# EAGLE design Soil_Moisture_Sensor (EAGLE 8.3.2)
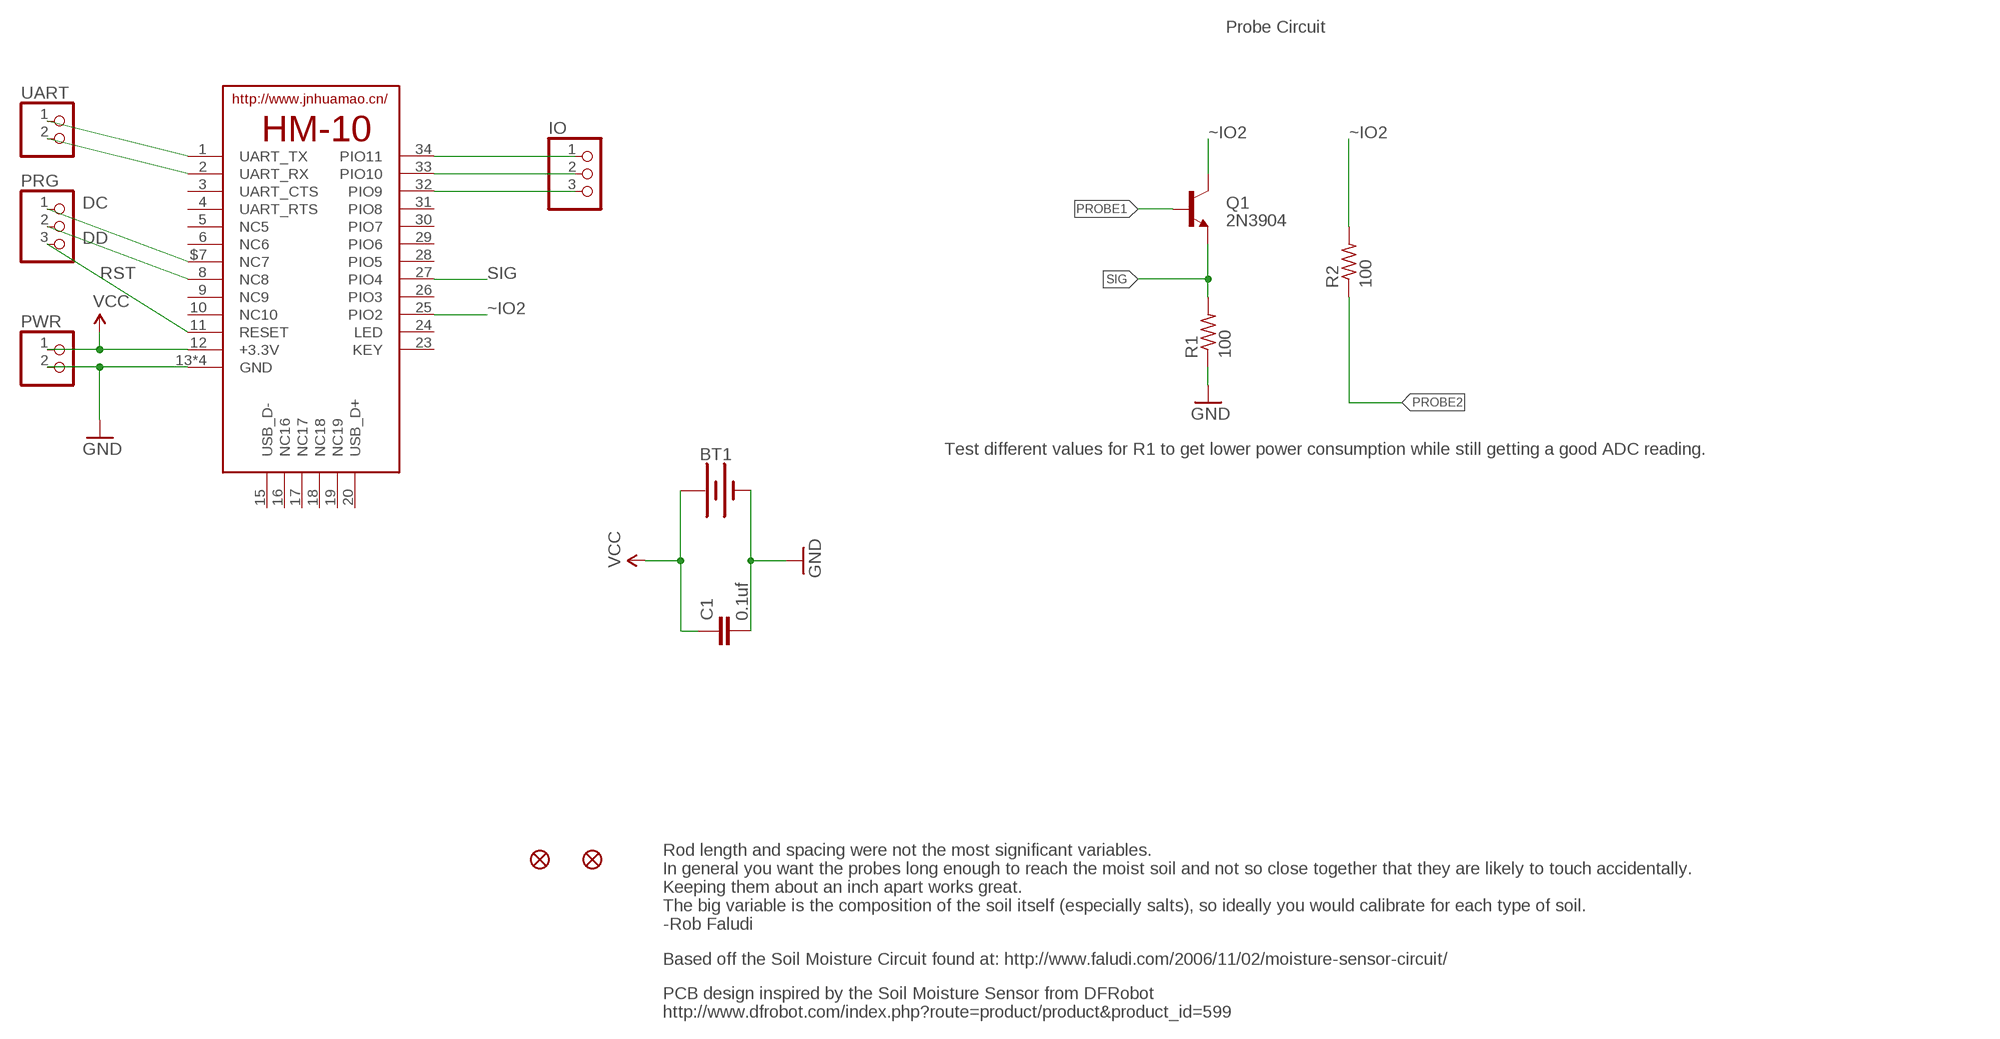
[diagram p0: schematic, sheet 1]

## Parts
BT1  BATTERY-20MM_SMD_4LEGS  [BATTCON_20MM_4LEGS]
C1  0.1uf  C-EUC0805  [C0805]
FD1  FIDUCIAL1X2  [FIDUCIAL-1X2]
FD2  FIDUCIAL1X2  [FIDUCIAL-1X2]
HM-10  HM-10-BOARD  [26.9X13X2.2_BOARD]
IO  PINHD-1X3  [1X03]
PRG  PINHD-1X3  [1X03]
PWR  PINHD-1X2  [1X02]
Q1  2N3904  TRANSISTOR_NPNMMBT2222A  [SOT23-3]
R1  100  R-US_R0805  [R0805]
R2  100  R-US_R0805  [R0805]
UART  PINHD-1X2  [1X02]

## Nets
DC: HM-10.$7(NC7) PRG.1
DD: HM-10.8(NC8) PRG.2
GND: BT1.NEGATIVE(-) C1.2 HM-10.13(GND) HM-10.14(GND) HM-10.21(GND) HM-10.22(GND) PWR.2 R1.1
N$2: HM-10.34(PIO11) IO.1
N$3: HM-10.33(PIO10) IO.2
N$4: HM-10.32(PIO9) IO.3
N$10: HM-10.1(UART_TX) UART.1
N$11: HM-10.2(UART_RX) UART.2
PROBE1: Q1.1(B)
PROBE2: R2.1
RST: HM-10.11(RESET) PRG.3
SIG: HM-10.27(PIO4) Q1.2(E) R1.2
VCC: BT1.POSITIVE@1(+) BT1.POSITIVE@2(+) BT1.POSITIVE@3(+) BT1.POSITIVE@4(+) C1.1 HM-10.12(+3.3V) PWR.1
~IO2: HM-10.25(PIO2) Q1.3(C) R2.2
Unconnected: HM-10.3(UART_CTS) HM-10.4(UART_RTS) HM-10.5(NC5) HM-10.6(NC6) HM-10.9(NC9) HM-10.10(NC10) HM-10.15(USB_D-) HM-10.16(NC16) HM-10.17(NC17) HM-10.18(NC18) HM-10.19(NC19) HM-10.20(USB_D+) HM-10.23(KEY) HM-10.24(LED) HM-10.26(PIO3) HM-10.28(PIO5) HM-10.29(PIO6) HM-10.30(PIO7) HM-10.31(PIO8)

## Notes on the sheet
- Probe Circuit
- Test different values for R1 to get lower power consumption while still getting a good ADC reading.
- Rod length and spacing were not the most significant variables. 
  In general you want the probes long enough to reach the moist soil and not so close together that they are likely to touch accidentally. 
  Keeping them about an inch apart works great. 
  The big variable is the composition of the soil itself (especially salts), so ideally you would calibrate for each type of soil. 
  -Rob Faludi
- Based off the Soil Moisture Circuit found at: http://www.faludi.com/2006/11/02/moisture-sensor-circuit/
- PCB design inspired by the Soil Moisture Sensor from DFRobot
  http://www.dfrobot.com/index.php?route=product/product&product_id=599

## Library data of the parts
BT1 = SparkFun-Batteries:BATTERY: Battery - Single Cell A variety of battery chemistries, sizes, and footprints. Device List: 20MM_PTH - Coin Cell Battery Holder - 20mm (PTH) <https://www.sparkfun.com/products/783> 6.8MM_PTH - Coin Cell Battery Holder - 6.8MM(SMD) <https://www.digikey.com/product-detail/en/seiko-instruments/MS621FE-FL11E/728-1057-ND/1889208?WT.srch=1&gclid=CNOQ5a6LzdQCFZS2wAodXCkE0g> 12MM_SMD - Coin Cell Battery Holder - 12mm (SMD) <https://www.sparkfun.com/products/10592> 12MM_PTH - Coin Cell Battery Holder - 12mm (PTH) <https://www.sparkfun.com/products/7948> 20MM_SMD - 20mm Coin Cell Battery Holder (SMD) (2 legs) Used on the Big Time Watch Kit <https://www.sparkfun.com/products/11734> 20MM_SMD_4LEGS - Coin Cell Battery Holder - 20mm (SMD) <https://www.sparkfun.com/products/11892> 20MM_SMD_4LEGS_OVERPASTE - Coin Cell Battery Holder - 20mm (SMD) <https://www.sparkfun.com/products/11892> (Over-paste on the legs) 24.5MM_PTH - Coin Cell Battery Holder - 24.5mm (PTH) <https://www.sparkfun.com/products/8863> 9V - 9V Battery Holder - PC Mount Used on the SparkFun SparkPunk Sound Kit <https://www.sparkfun.com/products/11177> and SparkFun SparkPunk Sequencer Kit <https://www.sparkfun.com/products/12707> 18650 - Battery Holder - 18650 (PTH) <https://www.sparkfun.com/products/13113> AA - Battery Holder - 1xAA (PTH) <https://www.sparkfun.com/products/7949> AAA - Battery Holder - 1xAAA (PTH) <https://www.sparkfun.com/products/12718> AA_KIT - Battery Holder - 1xAA (PTH) <https://www.sparkfun.com/products/7949> Special kit package - pads only have exposed copper on one side of the board. AAA_KIT - Battery Holder - 1xAAA (PTH) <https://www.sparkfun.com/products/12718> Special kit package - pads only have exposed copper on one side of the board.; PROD_ID: BATT-10373; SF_SKU: PRT-11892
C1 = rcl:C-EU: CAPACITOR, European symbol
FD1 FD2 = SparkFun-Aesthetics:FIDUCIAL: Fiducial Alignment Points Point-of-reference for pick-and-place machines and other optical instruments.
HM-10 = JNHuaMao:HM-10: HM Bluetooth module use TI CC2540 or CC2541, Master and slave roles in one, transmission version and remote control version and PIO state acquisition functions in one, Support the AT command modify module parameters, Convenient and flexible.
IO PRG = pinhead:PINHD-1X3: PIN HEADER
PWR UART = pinhead:PINHD-1X2: PIN HEADER
Q1 = SparkFun-DiscreteSemi:TRANSISTOR_NPN: Generic NPN BJT MMBT2222A - TRANS-08049 (SOT-23, 1A 40V) MPSA42 - TRANS-09116 (SOT-23, 500mA 300V) MMBT5088LT1G - TRANS-11160 (SOT-23, 50 mA 30V) BC547 - COM-08928 <http://www.sparkfun.com/products/8928> (TO-92 45V 100mA) (1.Collector 2.Base 3.Emitter) 2N3904 - COM-00521 <http://www.sparkfun.com/products/521> (TO-92 40V 200mA) (1.Emitter 2.Base 3.Collector) P2N2222A - COM-12852 <http://www.sparkfun.com/products/12852> (TO-92 40V 600mA) (1.Collector 2.Base 3.Emitter); PROD_ID: TRANS-08049; VALUE: MMBT2222A
R1 R2 = resistor:R-US_: RESISTOR, American symbol

## Board
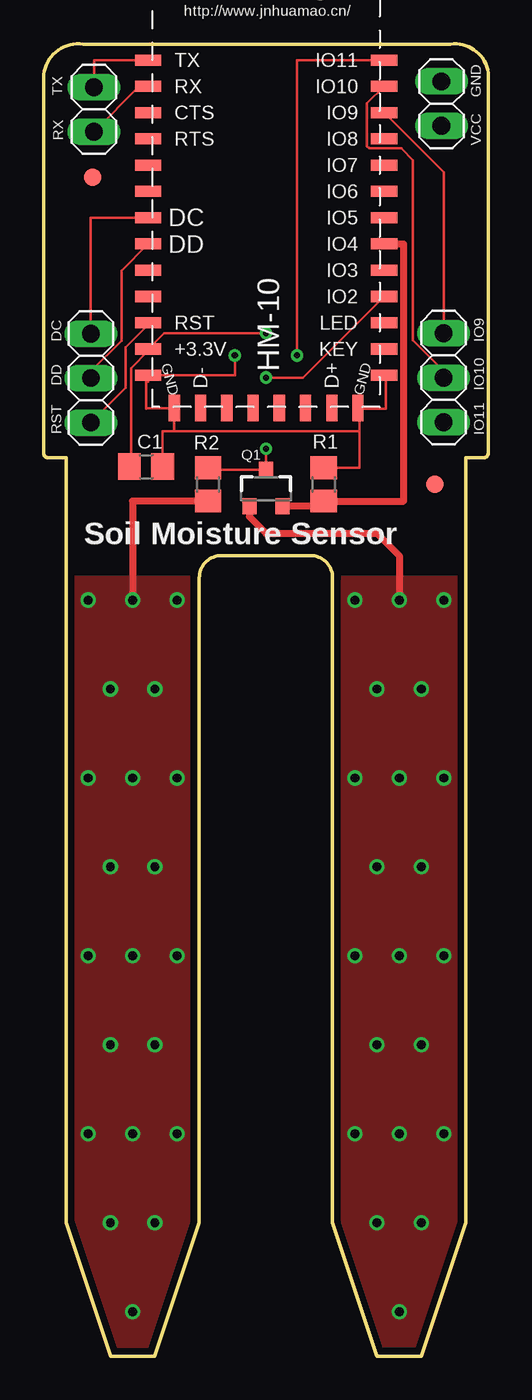
[diagram p1: board, top side]
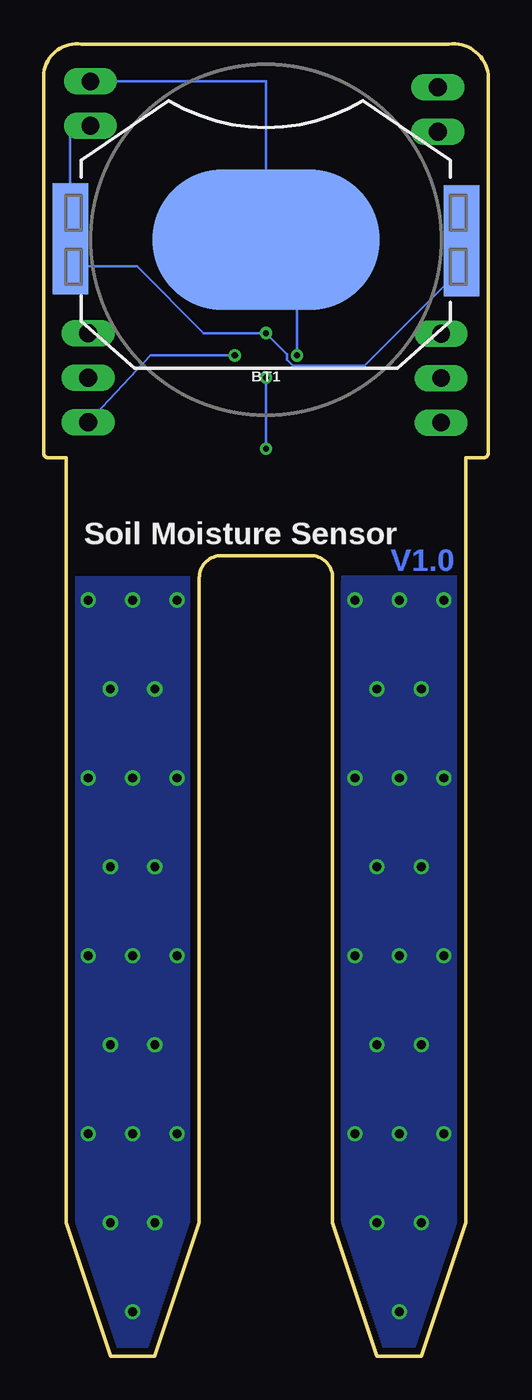
[diagram p2: board, bottom side, seen from below]

Size 25.4 x 74.95 mm. Coordinates in mm from the lower left corner, seen from the top.
Outline: 1.27,7.62 1.27,51.31 0.25,51.31 arc-90 0,51.56 0,73.2 arc-90 2.24,74.93 23.25,74.93 arc-90 25.4,73.29 25.4,51.56 arc-90 25.15,51.31 24.13,51.31 24.13,7.62 21.59,0 19.05,0 16.51,7.62 16.51,44.45 arc90 15.24,45.72 10.16,45.72 arc90 8.89,44.45 8.89,7.62 6.35,0 3.81,0 1.27,7.62
Copper layers (1*16): Top 0.0356mm / dielectric 1.5011mm / Bottom 0.0356mm
Design rules "oshpark-2layer": minimum track width 6mil, minimum drill 13mil, track to track 6mil, track to pad 6mil, pad to pad 6mil, via to via 6mil, smd to smd 6mil, copper to edge 15mil, drill to drill 6mil, minimum pad ring 7mil, minimum via ring 7mil, stop-mask expansion 2.5mil, vias tented up to drill 0mil, thermal gap 10mil

### Footprints (pad centres in the part's own frame; a part is rotated, then mirrored left to right if it is on the bottom)
BATTCON_20MM_4LEGS = smd 13 x 8: NEGATIVE 0,0 | smd 2.032 x 3.175: POSITIVE@1 -11.176,1.651; POSITIVE@2 -11.176,-1.524; POSITIVE@3 11.176,1.524; POSITIVE@4 11.176,-1.651
C0805 = smd 1.3 x 1.5: 1 -0.95,0; 2 0.95,0
FIDUCIAL-1X2 = smd 1 x 1: 1 0,0
26.9X13X2.2_BOARD = smd 1.5 x 0.635: 1 -7.5,0; 2 -7.5,-1.5; 3 -7.5,-3; 4 -7.5,-4.5; 5 -7.5,-6; 6 -7.5,-7.5; 8 -7.5,-10.5; 9 -7.5,-12; 10 -7.5,-13.5; 11 -7.5,-15; 12 -7.5,-16.5; 13 -7.5,-18; 22 6,-18; 23 6,-16.5; 24 6,-15; 25 6,-13.5; 26 6,-12; 27 6,-10.5; 28 6,-9; 29 6,-7.5; 30 6,-6; 31 6,-4.5; 32 6,-3; 33 6,-1.5; 34 6,0; $7 -7.5,-9 | smd 0.635 x 1.5: 14 -6,-19.875; 15 -4.5,-19.875; 16 -3,-19.875; 17 -1.5,-19.875; 18 0,-19.875; 19 1.5,-19.875; 20 3,-19.875; 21 4.5,-19.875
1X03 = drill 1.016 long: 1 -2.54,0; 2 0,0; 3 2.54,0
1X02 = drill 1.016 long: 1 -1.27,0; 2 1.27,0
SOT23-3 = smd 0.8 x 0.9: 1 -0.95,-1; 2 0.95,-1; 3 0,1.1
R0805 = smd 1.3 x 1.5: 1 -0.95,0; 2 0.95,0

### Placement (x,y rotation side)
BT1  12.7,63.75 180 bottom
C1  5.84,50.8 0 top
FD1  2.79,67.31 0 top
FD2  22.35,49.78 0 top
HM-10  13.46,74.02 0 top
IO  22.86,55.88 90 top
PRG  2.69,55.85 270 top
PWR  22.73,71.53 90 top
Q1  12.7,49.53 0 top
R1  16,49.78 270 top
R2  9.4,49.78 90 top
UART  2.87,71.2 270 top

### Tracks (layer width: path | path; a pad name or v marks a point on that pad's centre or on a via)
DC
  Top 0.152: 5.96,64.91 HM-10.$7 2.69,65.02 PRG.1
DD
  Top 0.152: PRG.2 2.69,56.23 4.45,57.98 4.45,62 HM-10.8
GND  (via drill 0.35)
  Top 0.152: 5.96,55.64 HM-10.13 | HM-10.14 7.57,54.14 | HM-10.13 5.84,55.9 5.84,54.1 5.88,54.14 HM-10.14 | HM-10.22 19.56,56.02 19.56,54.1 17.96,54.1 HM-10.21 18.03,54.14 18.03,52.83 | 7.46,52.83 HM-10.14 | 18.03,52.83 7.46,52.83 | HM-10.13 10.92,56.02 v10.92,57.15 | C1.2 6.79,52.83 7.46,52.83 | R1.1 18.03,50.73 18.03,52.83
  Bottom 0.152: v10.92,57.15 10.92,63.75 BT1.NEGATIVE 12.7,72.8 PWR.2
N$2  (via drill 0.35)
  Top 0.152: HM-10.34 14.48,74.02 v14.48,57.15
  Bottom 0.152: v14.48,57.15 19.3,57.15 IO.1
N$3
  Top 0.152: IO.2 22.86,56.26 21.11,58.01 21.11,68.3 20.44,68.97 18.62,68.97 18.48,69.1 18.48,71.54 HM-10.33
N$4
  Top 0.152: HM-10.32 22.86,67.62 IO.3
N$10
  Top 0.152: HM-10.1 2.87,74.02 UART.1
N$11
  Top 0.152: HM-10.2 5.46,72.52 UART.2
PROBE1  (via drill 0.51)
  Top 0.406: Q1.1 11.75,47.94 12.7,46.99 19.05,46.99 20.32,45.72 v20.32,43.18
  other vias: 17.78,43.18 22.86,43.18 22.86,33.02 20.32,33.02 17.78,33.02 17.78,22.86 20.32,22.86 22.86,22.86 22.86,12.7 20.32,12.7 17.78,12.7 19.05,7.62 21.59,7.62 20.32,2.54 19.05,38.1 21.59,38.1 21.59,27.94 19.05,27.94 19.05,17.78 21.59,17.78
  pour Top: 16.51,44.45 16.51,0 24.13,0 24.13,44.45
  pour Bottom (isolate 0.305): 16.51,44.45 16.51,0 24.13,0 24.13,44.45
PROBE2  (via drill 0.51)
  Top 0.406: R2.1 5.08,48.83 v5.08,43.18
  other vias: 7.62,43.18 2.54,43.18 2.54,33.02 5.08,33.02 7.62,33.02 7.62,22.86 5.08,22.86 2.54,22.86 2.54,12.7 5.08,12.7 7.62,12.7 6.35,7.62 3.81,7.62 5.08,2.54 3.81,17.78 6.35,17.78 3.81,27.94 6.35,27.94 3.81,38.1 6.35,38.1
  pour Top: 1.27,44.45 1.27,0 8.89,0 8.89,44.45
  pour Bottom: 1.27,44.45 1.27,0 8.89,0 8.89,44.45
RST
  Top 0.152: PRG.3 4.68,55.3 4.68,57.62 5.96,58.91 HM-10.11
SIG
  Top 0.406: Q1.2 15.7,48.53 R1.2 20.57,48.83 20.57,63.5 19.46,63.5 HM-10.27
VCC  (via drill 0.35)
  Top 0.152: v12.7,58.42 6.87,58.42 HM-10.12 5.96,57.41 4.98,56.43 4.98,50.89 C1.1
  Bottom 0.152: BT1.POSITIVE@2 BT1.POSITIVE@1 7.06,56.57 11.16,56.57 11.5,56.91 11.5,57.22 v12.7,58.42 16.26,58.42 20.07,62.23 BT1.POSITIVE@3 23.88,65.28 | 23.88,65.28 BT1.POSITIVE@4 | PWR.1 23.88,70.26 23.88,65.28
~IO2  (via drill 0.35)
  Top 0.152: v12.7,51.82 Q1.3 9.4,50.63 | v12.7,55.88 14.83,55.88 HM-10.25
  Top 0.406: 9.4,50.63 R2.2
  Bottom 0.152: v12.7,55.88 v12.7,51.82

### Text on the board
Bottom: V1.0
tPlace: TX | GND | RX | VCC | DC | DD | DC | IO9 | DD | IO10 | RST | IO11 | Soil Moisture Sensor
bPlace: Soil Moisture Sensor